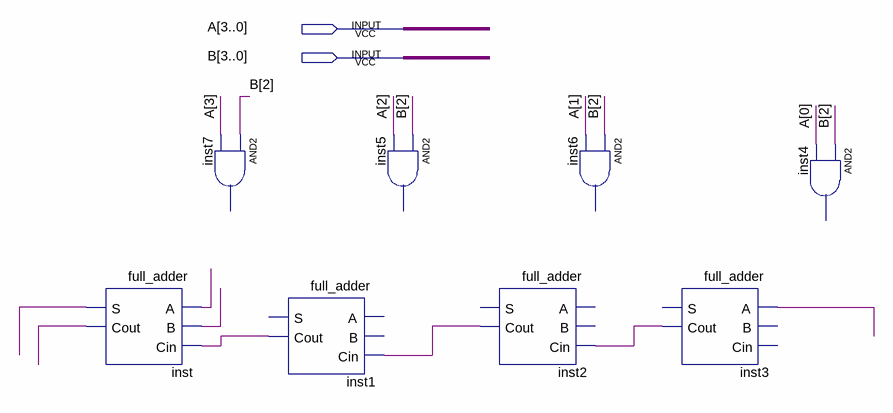
[diagram p0: schematic sheet]
// Quartus schematic LEVEL_2.bdf as structural Verilog: 8 symbols, 2 pins
module LEVEL_2 (
  input  [3:0] A,
  input  [3:0] B
);

  wire inst1_cout, inst2_cout, inst3_cout, inst_cout, inst_s, undriven, undriven_2, undriven_3;

  full_adder inst (.A(undriven_2), .B(undriven_3), .Cin(inst1_cout), .S(inst_s), .Cout(inst_cout));
  // AND2 inst7 has open pins: IN1=B[2], IN2=A[3], OUT=open
  full_adder inst1 (.Cin(inst2_cout), .Cout(inst1_cout));  // open: A, B, S
  // AND2 inst5 has open pins: IN1=B[2], IN2=A[2], OUT=open
  full_adder inst2 (.Cin(inst3_cout), .Cout(inst2_cout));  // open: A, B, S
  // AND2 inst6 has open pins: IN1=B[2], IN2=A[1], OUT=open
  full_adder inst3 (.A(undriven), .Cout(inst3_cout));  // open: B, Cin, S
  // AND2 inst4 has open pins: IN1=B[2], IN2=A[0], OUT=open
endmodule
